# EAGLE board harp expander (EAGLE 9.5.1), part 1 of 2
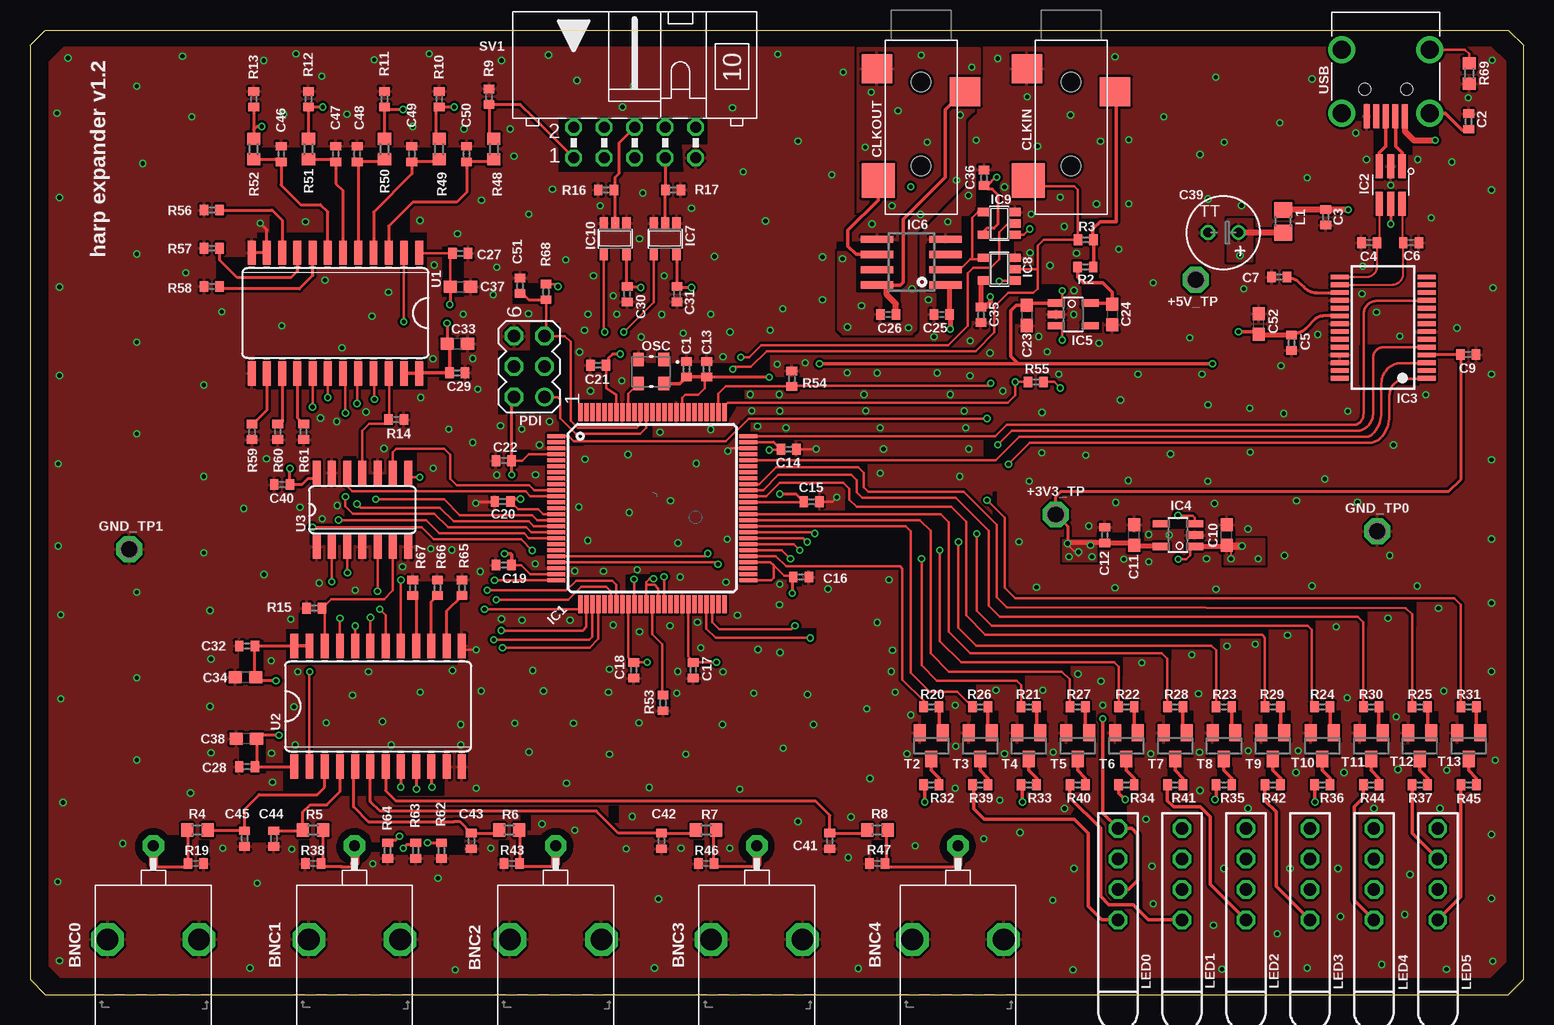
[diagram p2: board, top side]
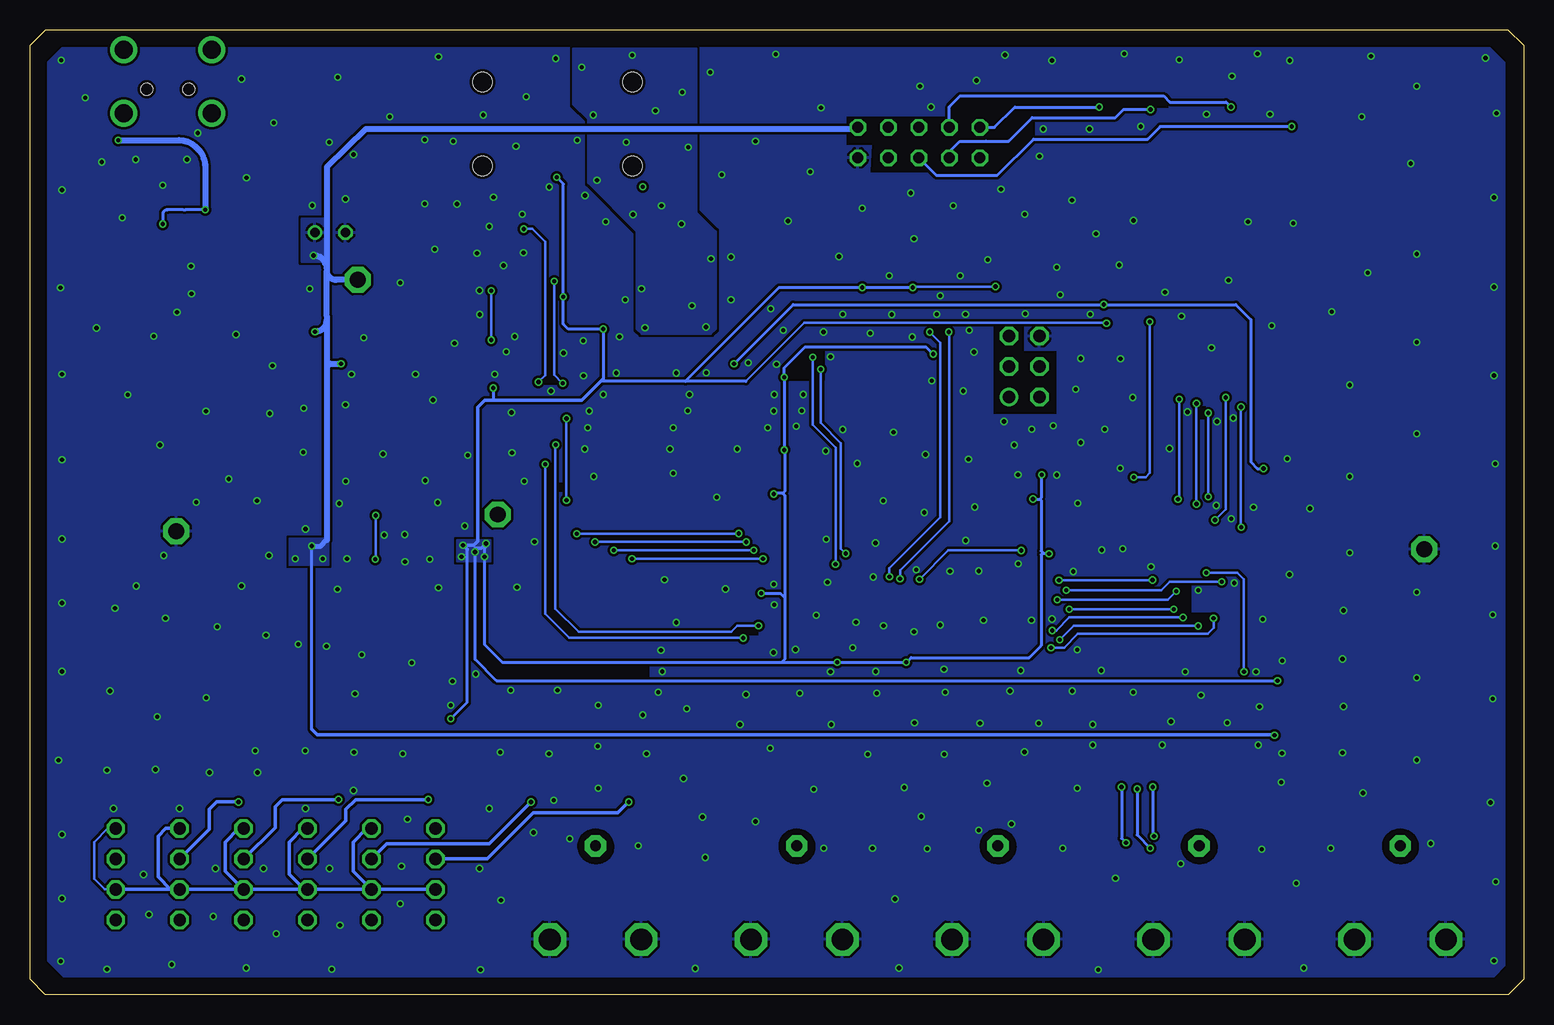
[diagram p3: board, bottom side, seen from below]

Size 124.46 x 80.38 mm. Coordinates in mm from the lower left corner, seen from the top.
Outline: 0,79.11 0,1.27 1.27,0 123.19,0 124.46,1.27 124.46,79.11 123.19,80.38 1.27,80.38 0,79.11
Copper layers (1*16): Top 0.018mm / dielectric 0.36mm / Bottom 0.018mm
Design rules "harp PCB design rules": minimum track width 0.15mm, minimum drill 0.35mm, track to track 6mil, track to pad 6mil, pad to pad 6mil, via to via 6mil, smd to smd 6mil, copper to edge 0.25mm, drill to drill 0.35mm, minimum pad ring 0.175mm, minimum via ring 0.125mm, stop-mask expansion 0mil, vias tented up to drill 0.45mm, thermal gap 0.2mm
Net classes: 0 default: clearance 0.205 mm; 1 IOss: clearance 0.35 mm
bKeepout: area 122.4,0.5 to 125,80.5

## Footprints (pad centres in the part's own frame; a part is rotated, then mirrored left to right if it is on the bottom)
P1-13 = drill 1.321 pad 2.159 octagon: TP 0,0
0731000105 = drill 0.914 pad 1.778 octagon: 1 0,12.395 | drill 1.803 octagon: 2 -3.81,4.597; 3 3.81,4.597
C0402 = smd 0.7 x 0.9: 1 -0.65,0; 2 0.65,0
C0603 = smd 1.1 x 1: 1 -0.85,0; 2 0.85,0
TT2D6 = drill 0.813: + -1.27,0 | drill 0.813 octagon: - 1.27,0
35RASMT2BHNTRX = smd 2.4 x 2.55: 1 0.8,3.675; 5 -1.1,-3.675 | smd 2.9 x 2.75: 4 8.2,-3.575 | hole 1.6: 0,0; 7,0
TQFP100 = smd 1.5 x 0.35: 1 -8,6; 2 -8,5.5; 3 -8,5; 4 -8,4.5; 5 -8,4; 6 -8,3.5; 7 -8,3; 8 -8,2.5; 9 -8,2; 10 -8,1.5; 11 -8,1; 12 -8,0.5; 13 -8,0; 14 -8,-0.5; 15 -8,-1; 16 -8,-1.5; 17 -8,-2; 18 -8,-2.5; 19 -8,-3; 20 -8,-3.5; 21 -8,-4; 22 -8,-4.5; 23 -8,-5; 24 -8,-5.5; 25 -8,-6; 51 8,-6; 52 8,-5.5; 53 8,-5; 54 8,-4.5; 55 8,-4; 56 8,-3.5; 57 8,-3; 58 8,-2.5; 59 8,-2; 60 8,-1.5; 61 8,-1; 62 8,-0.5; 63 8,0; 64 8,0.5; 65 8,1; 66 8,1.5; 67 8,2; 68 8,2.5; 69 8,3; 70 8,3.5; 71 8,4; 72 8,4.5; 73 8,5; 74 8,5.5; 75 8,6 | smd 0.35 x 1.5: 26 -6,-8; 27 -5.5,-8; 28 -5,-8; 29 -4.5,-8; 30 -4,-8; 31 -3.5,-8; 32 -3,-8; 33 -2.5,-8; 34 -2,-8; 35 -1.5,-8; 36 -1,-8; 37 -0.5,-8; 38 0,-8; 39 0.5,-8; 40 1,-8; 41 1.5,-8; 42 2,-8; 43 2.5,-8; 44 3,-8; 45 3.5,-8; 46 4,-8; 47 4.5,-8; 48 5,-8; 49 5.5,-8; 50 6,-8; 76 6,8; 77 5.5,8; 78 5,8; 79 4.5,8; 80 4,8; 81 3.5,8; 82 3,8; 83 2.5,8; 84 2,8; 85 1.5,8; 86 1,8; 87 0.5,8; 88 0,8; 89 -0.5,8; 90 -1,8; 91 -1.5,8; 92 -2,8; 93 -2.5,8; 94 -3,8; 95 -3.5,8; 96 -4,8; 97 -4.5,8; 98 -5,8; 99 -5.5,8; 100 -6,8
SOT23-6L = smd 0.6 x 2: P$1 -0.95,-1.55; P$2 0,-1.55; P$3 0.95,-1.55; P$4 0.95,1.55; P$5 0,1.55; P$6 -0.95,1.55
SSOP28 = smd 0.4 x 1.5: 1 -4.225,-3.625; 2 -3.575,-3.625; 3 -2.925,-3.625; 4 -2.275,-3.625; 5 -1.625,-3.625; 6 -0.975,-3.625; 7 -0.325,-3.625; 8 0.325,-3.625; 9 0.975,-3.625; 10 1.625,-3.625; 11 2.275,-3.625; 12 2.925,-3.625; 13 3.575,-3.625; 14 4.225,-3.625; 15 4.225,3.625; 16 3.575,3.625; 17 2.925,3.625; 18 2.275,3.625; 19 1.625,3.625; 20 0.975,3.625; 21 0.325,3.625; 22 -0.325,3.625; 23 -0.975,3.625; 24 -1.625,3.625; 25 -2.275,3.625; 26 -2.925,3.625; 27 -3.575,3.625; 28 -4.225,3.625
TSOT23-5 = smd 0.6 x 1.408: 1 -0.95,-1.404; 2 0,-1.404; 3 0.95,-1.404; 4 0.95,1.404; 5 -0.95,1.404
SO-08 = smd 0.6 x 2.708: 1 -1.905,-2.854; 2 -0.635,-2.854; 3 0.635,-2.854; 4 1.905,-2.854; 5 1.905,2.854; 6 0.635,2.854; 7 -0.635,2.854; 8 -1.905,2.854
SOT23-5 = smd 0.69 x 0.99: 1 -0.95,-1.29; 2 0,-1.29; 3 0.95,-1.29; 4 0.95,1.3; 5 -0.95,1.3
R0805 = smd 1.3 x 1.5: 1 -0.95,0; 2 0.95,0
569-011X-X00_LED_ARRAY = drill 1.016 octagon: A1 -6.35,0; A2 -1.27,0; C1 -8.89,0; C2 -3.81,0
OSCILLATOR_3.2X2.5 = smd 0.9 x 1.1: P$1 -1.05,-1; P$2 1.05,-1; P$3 1.05,1; P$4 -1.05,1
MA03-2 = drill 1.016: 1 -2.54,-1.27 | drill 1.016 octagon: 2 -2.54,1.27; 3 0,-1.27; 4 0,1.27; 5 2.54,-1.27; 6 2.54,1.27
R0402 = smd 0.7 x 0.9: 1 -0.65,0; 2 0.65,0
R0603 = smd 1 x 1.1: 1 -0.85,0; 2 0.85,0
ML10L = drill 0.914 octagon: 1 -5.08,-1.27; 2 -5.08,1.27; 3 -2.54,-1.27; 4 -2.54,1.27; 5 0,-1.27; 6 0,1.27; 7 2.54,-1.27; 8 2.54,1.27; 9 5.08,-1.27; 10 5.08,1.27
SOT23 = smd 1 x 1.4: 1 -0.95,-1.1; 2 0.95,-1.1; 3 0,1.1
SO24L = smd 0.66 x 2.032: 1 -6.985,-5.029; 2 -5.715,-5.029; 3 -4.445,-5.029; 4 -3.175,-5.029; 5 -1.905,-5.029; 6 -0.635,-5.029; 7 0.635,-5.029; 8 1.905,-5.029; 9 3.175,-5.029; 10 4.445,-5.029; 11 5.715,-5.029; 12 6.985,-5.029; 13 6.985,5.029; 14 5.715,5.029; 15 4.445,5.029; 16 3.175,5.029; 17 1.905,5.029; 18 0.635,5.029; 19 -0.635,5.029; 20 -1.905,5.029; 21 -3.175,5.029; 22 -4.445,5.029; 23 -5.715,5.029; 24 -6.985,5.029
SO14 = smd 0.66 x 2.032: 1 -3.81,-3.073; 2 -2.54,-3.073; 3 -1.27,-3.073; 4 0,-3.073; 5 1.27,-3.073; 6 2.54,-3.073; 7 3.81,-3.073; 8 3.81,3.073; 9 2.54,3.073; 10 1.27,3.073; 11 0,3.073; 12 -1.27,3.073; 13 -2.54,3.073; 14 -3.81,3.073
240-0002-1 = smd 0.5 x 2: P$1 -1.6,8.65; P$2 -0.8,8.65; P$3 0,8.65; P$4 0.8,8.65; P$5 1.6,8.65 | drill 1.5: SHIELD_1 -3.65,3.1; SHIELD_2 3.65,3.1; SHIELD_3 3.65,8.4; SHIELD_4 -3.65,8.4 | hole 1: -1.75,6.4; 1.75,6.4

## Placement (x,y rotation side)
+3V3_TP  TPPAD1-13  [P1-13]  85.49,40.01 0 top
+5V_TP  TPPAD1-13  [P1-13]  97.16,59.56 0 top
BNC0  BNC plug  [0731000105]  10.28,0 0 top
BNC1  BNC plug  [0731000105]  27.04,0 0 top
BNC2  BNC plug  [0731000105]  43.81,0 0 top
BNC3  BNC plug  [0731000105]  60.57,0 0 top
BNC4  BNC plug  [0731000105]  77.33,0 0 top
C1  100nF  [C0402]  54.71,52.12 90 top
C2  4.7nF  [C0402]  119.89,72.76 90 top
C3  100nF  [C0402]  107.98,64.77 270 top
C4  47pF  [C0402]  111.61,62.66 180 top
C5  100nF  [C0402]  105.13,54.33 270 top
C6  47pF  [C0402]  115.09,62.66 0 top
C7  100nF  [C0402]  104.11,59.79 180 top
C9  100nF  [C0402]  119.86,53.34 0 top
C10  4.7uF  [C0603]  99.72,38.29 90 top
C11  4.7uF  [C0603]  92,38.29 90 top
C12  100nF  [C0402]  89.56,38.29 90 top
C13  100nF  [C0402]  56.39,52.12 90 top
C14  100nF  [C0402]  63.22,45.44 0 top
C15  100nF  [C0402]  65.13,41.07 0 top
C16  100nF  [C0402]  64.26,34.8 0 top
C17  100nF  [C0402]  55.27,27.03 270 top
C18  100nF  [C0402]  50.32,27.03 270 top
C19  100nF  [C0402]  39.48,35.8 180 top
C20  100nF  [C0402]  39.38,41.09 180 top
C21  100nF  [C0402]  47.36,52.45 180 top
C22  100nF  [C0402]  39.48,44.5 180 top
C23  4.7uF  [C0603]  83.06,56.61 270 top
C24  4.7uF  [C0603]  90.19,56.68 270 top
C25  100nF  [C0402]  75.98,56.68 180 top
C26  100nF  [C0402]  71.51,56.68 180 top
C27  100nF  [C0402]  35.86,61.77 0 top
C28  100nF  [C0402]  18.08,18.99 180 top
C29  100nF  [C0402]  35.61,51.81 0 top
C30  100nF  [C0402]  49.76,58.37 270 top
C31  100nF  [C0402]  53.92,58.37 270 top
C32  100nF  [C0402]  18.08,29.05 180 top
C33  4.7uF  [C0603]  35.61,54.25 0 top
C34  4.7uF  [C0603]  17.96,26.43 180 top
C35  100nF  [C0402]  79.25,56.64 270 top
C36  100nF  [C0402]  79.5,68.07 90 top
C37  4.7uF  [C0603]  35.86,58.97 0 top
C38  4.7uF  [C0603]  18.03,21.33 180 top
C39  100u 25V  [TT2D6]  99.44,63.5 180 top
C40  100nF  [C0402]  21,42.5 180 top
C41  330pF  [C0402]  66.65,12.8 270 top
C42  330pF  [C0402]  52.63,12.8 270 top
C43  330pF  [C0402]  36.78,12.8 270 top
C44  330pF  [C0402]  20.32,13 270 top
C45  330pF  [C0402]  17.88,13 270 top
C46  330pF  [C0402]  20.94,70.05 90 top
C47  330pF  [C0402]  25.48,70.05 90 top
C48  330pF  [C0402]  27.26,70.05 90 top
C49  330pF  [C0402]  31.82,70.05 90 top
C50  330pF  [C0402]  36.38,70.05 90 top
C51  330pF  [C0402]  40.84,59.07 90 top
C52  4.7uF  [C0603]  102.41,55.88 90 top
CLKIN  CLCK_JACK  [35RASMT2BHNTRX]  86.75,76.05 270 top
CLKOUT  CLCK_JACK  [35RASMT2BHNTRX]  74.25,76.05 270 top
GND_TP0  TPPAD1-13  [P1-13]  112.27,38.61 0 top
GND_TP1  TPPAD1-13  [P1-13]  8.27,37.11 0 top
IC1  XMEGA-A1TQFP  [TQFP100]  51.87,40.54 0 top
IC2  USBLC6-2SC6  [SOT23-6L]  113.39,67.46 180 top
IC3  FT232RL  [SSOP28]  112.75,55.58 90 top
IC4  TLV70033DDCR  [TSOT23-5]  95.66,38.29 90 top
IC5  TLV70033DDCR  [TSOT23-5]  86.94,56.68 270 top
IC6  SI8610BC-B-IS  [SO-08]  73.44,61.05 90 top
IC7  SN74LVC1G125DBVT  [SOT23-5]  52.93,62.99 180 top
IC8  SN74LVC1G125DBVT  [SOT23-5]  80.77,60.45 90 top
IC9  SN74LVC1G125DBVT  [SOT23-5]  80.77,64.26 90 top
IC10  SN74LVC1G125DBVT  [SOT23-5]  48.77,62.99 180 top
L1  40R@100MHz  [R0805]  104.44,64.44 90 top
LED0  RED_LEDs  [569-011X-X00_LED_ARRAY]  90.67,15.11 90 top
LED1  RED_LEDs  [569-011X-X00_LED_ARRAY]  96,15.11 90 top
LED2  RED_LEDs  [569-011X-X00_LED_ARRAY]  101.33,15.11 90 top
LED3  RED_LEDs  [569-011X-X00_LED_ARRAY]  106.66,15.11 90 top
LED4  RED_LEDs  [569-011X-X00_LED_ARRAY]  111.99,15.11 90 top
LED5  RED_LEDs  [569-011X-X00_LED_ARRAY]  117.32,15.11 90 top
OSC  Oscillator  [OSCILLATOR_3.2X2.5]  51.77,51.92 180 top
PDI  PROG HEADER  [MA03-2]  41.61,52.34 90 top
R2  10R  [R0402]  87.95,60.64 0 top
R3  10k  [R0402]  87.98,62.91 180 top
R4  100R  [R0603]  13.94,13.72 0 top
R5  100R  [R0603]  23.59,13.72 180 top
R6  100R  [R0603]  39.94,13.72 180 top
R7  100R  [R0603]  56.34,13.72 180 top
R8  100R  [R0603]  70.61,13.72 180 top
R9  10k  [R0402]  38.25,74.82 90 top
R10  10k  [R0402]  34.1,74.62 90 top
R11  10k  [R0402]  29.54,74.62 90 top
R12  10k  [R0402]  23.2,74.62 90 top
R13  10k  [R0402]  18.64,74.62 90 top
R14  10k  [R0402]  30.51,47.92 180 top
R15  10k  [R0402]  23.7,32.2 0 top
R16  10k  [R0402]  48.01,67.06 180 top
R17  10k  [R0402]  53.59,67.06 0 top
R19  10k  [R0402]  13.82,10.92 180 top
R20  1k  [R0402]  75.11,23.98 0 top
R21  1k  [R0402]  83.24,23.98 0 top
R22  1k  [R0402]  91.37,23.98 0 top
R23  1k  [R0402]  99.5,23.98 0 top
R24  1k  [R0402]  107.7,23.98 0 top
R25  1k  [R0402]  115.82,23.98 0 top
R26  1k  [R0402]  79.18,23.98 0 top
R27  1k  [R0402]  87.3,23.98 0 top
R28  1k  [R0402]  95.43,23.98 0 top
R29  1k  [R0402]  103.56,23.98 0 top
R30  1k  [R0402]  111.76,23.98 0 top
R31  1k  [R0402]  119.89,23.98 0 top
R32  330R  [R0402]  75.11,17.48 0 top
R33  330R  [R0402]  83.24,17.48 0 top
R34  330R  [R0402]  91.37,17.48 0 top
R35  330R  [R0402]  99.5,17.48 0 top
R36  330R  [R0402]  107.7,17.48 0 top
R37  330R  [R0402]  115.82,17.48 0 top
R38  10k  [R0402]  23.59,10.92 0 top
R39  330R  [R0402]  79.18,17.48 0 top
R40  330R  [R0402]  87.3,17.48 0 top
R41  330R  [R0402]  95.43,17.48 0 top
R42  330R  [R0402]  103.56,17.48 0 top
R43  10k  [R0402]  40.14,10.92 0 top
R44  330R  [R0402]  111.76,17.48 0 top
R45  330R  [R0402]  119.89,17.48 0 top
R46  10k  [R0402]  56.34,10.92 0 top
R47  10k  [R0402]  70.61,10.92 0 top
R48  100R  [R0603]  38.66,70.45 270 top
R49  100R  [R0603]  34.1,70.45 270 top
R50  100R  [R0603]  29.54,70.45 270 top
R51  100R  [R0603]  23.2,70.45 270 top
R52  100R  [R0603]  18.64,70.45 270 top
R53  10k  [R0402]  52.75,24.3 270 top
R54  10k  [R0402]  63.49,51.33 90 top
R55  10k  [R0402]  83.82,51.05 0 top
R56  10k  [R0402]  15.16,65.38 180 top
R57  10k  [R0402]  15.16,62.2 180 top
R58  10k  [R0402]  15.16,59.01 180 top
R59  10k  [R0402]  18.5,46.9 270 top
R60  10k  [R0402]  20.65,46.9 270 top
R61  10k  [R0402]  22.8,46.9 270 top
R62  10k  [R0402]  34.28,12 270 top
R63  10k  [R0402]  32.14,12 270 top
R64  10k  [R0402]  29.8,12 270 top
R65  10k  [R0402]  36,33.9 90 top
R66  10k  [R0402]  33.95,33.9 90 top
R67  10k  [R0402]  31.9,33.9 90 top
R68  10k  [R0402]  43,58.55 90 top
R69  100R  [R0603]  119.94,76.76 270 top
SV1  I/O Header  [ML10L]  50.39,71 0 top
T2  BC850  [SOT23]  75.11,20.73 180 top
T3  BC850  [SOT23]  79.18,20.73 180 top
T4  BC850  [SOT23]  83.24,20.73 180 top
T5  BC850  [SOT23]  87.3,20.73 180 top
T6  BC850  [SOT23]  91.37,20.73 180 top
T7  BC850  [SOT23]  95.43,20.73 180 top
T8  BC850  [SOT23]  99.5,20.73 180 top
T9  BC850  [SOT23]  103.56,20.73 180 top
T10  BC850  [SOT23]  107.7,20.73 180 top
T11  BC850  [SOT23]  111.76,20.73 180 top
T12  BC850  [SOT23]  115.82,20.73 180 top
T13  BC850  [SOT23]  119.89,20.73 180 top
U1  744245X  [SO24L]  25.45,56.79 180 top
U2  744245X  [SO24L]  29.01,24.02 0 top
U3  74HCT125SO14  [SO14]  27.7,40.41 0 top
USB  mini USB  [240-0002-1]  112.98,81.85 180 top